# Altium project Stabilizer.PrjPCB (part 5 of 5)

## Sheet References.SchDoc: Stabilizer
size 420 x 297 mm; Author: G.Kasprowicz; CompanyName: WUT ISE; DrawnBy: G.Kasprowicz; Organization: WUT ISE; Address1: PW ISE; Address2: Nowowiejska 15/19 00-665 Warsaw; Address3: gkasprow@gmail.com; DocumentNumber: 10; Revision: 3.4; SheetNumber: 10; SheetTotal: 11; ModifiedBy: -; CheckedDate: -; Title2: References; DivGrp: WUT ISE; Designer: G.Kasprowicz; ModifiedDate: -; ProjectName: Sensor Box
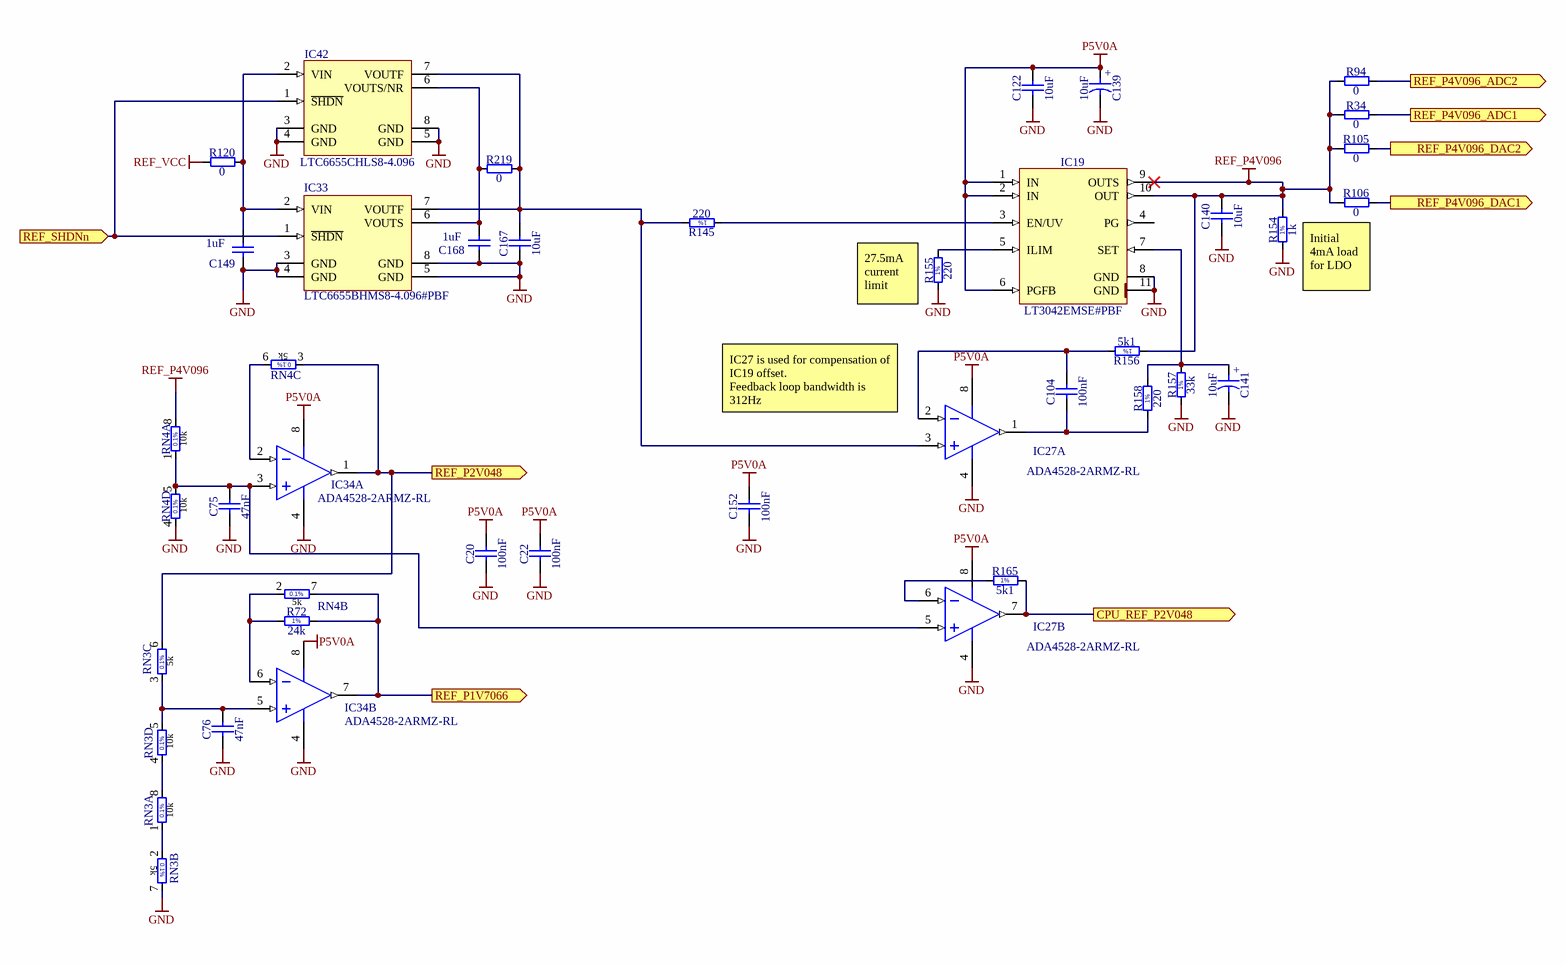
[diagram p8: References.SchDoc]

### Parts
C20  100nF  [CAPC1005X55N]
C22  100nF  [CAPC1005X55N]
C75  47nF  [CAPC2012X135N]
C76  47nF  [CAPC2012X135N]
C104  100nF  [CAPC1005X55N]
C122  10uF  [CAPC2012X95N]
C139  10uF  [CAPMP3216X180N]
C140  10uF  [CAPC2012X95N]
C141  10uF  [CAPMP3216X180N]
C149  1uF  [CAPC1608X87N]
C152  100nF  [CAPC1005X55N]
C167  10uF  [CAPC2012X95N]
C168  1uF  [CAPC1608X87N]
IC19  LT3042EMSE#PBF  [SOP50P490X110-11N-R168X198]
IC27  ADA4528-2ARMZ-RL  [ADI-RM-8_N]  (parts A,B of 2)
IC33  LTC6655BHMS8-4.096#PBF  [SOP65P490X110-8N]
IC34  ADA4528-2ARMZ-RL  [ADI-RM-8_N]  (parts A,B of 2)
IC42  LTC6655CHLS8-4.096  [LCCS127P500X500X145-8N]
R34  0  [RESC1005X40N]
R72  24k  [RESC1608X55N]
R94  0  [RESC1005X40N]
R105  0  [RESC1005X40N]
R106  0  [RESC1005X40N]
R120  0  [RESC1005X40N]
R145  220  [RESC1608X55N]
R154  1k  [RESC1608X55N]
R155  220  [RESC1608X55N]
R156  5k1  [RESC1005X40N]
R157  33k  [RESC1005X40N]
R158  220  [RESC1608X55N]
R165  5k1  [RESC1005X40N]
R219  0  [RESC1005X40N]
RN3  10k 5K 5K 10K  [SOIC127P600X175-8N]  (value not drawn)  (parts A,B,C,D of 4)
RN4  10k 5K 5K 10K  [SOIC127P600X175-8N]  (value not drawn)  (parts A,B,C,D of 4)

### Ports
CPU_REF_P2V048 (out), REF_P1V7066 (out), REF_P2V048 (out), REF_P4V096_ADC1 (out), REF_P4V096_ADC2 (out), REF_P4V096_DAC1 (out), REF_P4V096_DAC2 (out), REF_SHDNn (in)

### Nets
GND: C20.1 C22.1 C75.1 C76.1 C122.1 C139.2 C140.1 C141.2 C149.1 C152.1 C167.1 C168.1 IC19.8(GND) IC19.11(GND) IC27.4(-V) IC33.3(GND) IC33.4(GND) IC33.5(GND) IC33.8(GND) IC34.4(-V) IC42.3(GND) IC42.4(GND) IC42.5(GND) IC42.8(GND) R154.1 R155.1 R157.1 RN3.7 RN4.4
P5V0A: C20.2 C22.2 C122.2 C139.1 C152.2 IC19.1(IN) IC19.2(IN) IC19.6(PGFB) IC27.8(+V) IC34.8(+V)
REF_P4V096: C140.2 IC19.9(OUTS) IC19.10(OUT) R34.1 R94.1 R105.1 R106.1 R154.2 R156.1 RN4.8
REF_VCC: R120.1
CPU_REF_P2V048: IC27.7(OUT_B) R165.2 ; port CPU_REF_P2V048
REF_P1V7066: IC34.7(OUT_B) R72.2 RN4.7 ; port REF_P1V7066
REF_P2V048: IC34.1(OUT_A) RN3.6 RN4.3 ; port REF_P2V048
REF_P4V096_ADC: R94.2 ; port REF_P4V096_ADC2
REF_P4V096_ADC: R34.2 ; port REF_P4V096_ADC1  [a separate net that carries the same name]
REF_P4V096_DAC1: R106.2 ; port REF_P4V096_DAC1
REF_P4V096_DAC2: R105.2 ; port REF_P4V096_DAC2
REF_~{SHDN}: IC33.1(~{SHDN}) IC42.1(~{SHDN}) ; port REF_SHDNn
NetC75_2: C75.2 IC27.5(+IN_B) IC34.3(+IN_A) RN4.1 RN4.5
NetC76_2: C76.2 IC34.5(+IN_B) RN3.3 RN3.5
NetC104_1: C104.1 IC27.1(OUT_A) R158.1
NetC104_2: C104.2 IC27.2(-IN_A) R156.2
NetC141_1: C141.1 IC19.7(SET) R157.2 R158.2
NetC149_2: C149.2 IC33.2(VIN) IC42.2(VIN) R120.2
NetC167_2: C167.2 IC27.3(+IN_A) IC33.7(VOUTF) IC42.7(VOUTF) R145.2 R219.2
NetC168_2: C168.2 IC33.6(VOUTS) IC42.6(VOUTS/NR) R219.1
NetIC19_3: IC19.3(EN/UV) R145.1
NetIC19_5: IC19.5(ILIM) R155.2
NetIC27_6: IC27.6(-IN_B) R165.1
NetIC34_2: IC34.2(-IN_A) RN4.6
NetIC34_6: IC34.6(-IN_B) R72.1 RN4.2
NetRN3_1: RN3.1 RN3.2
NetRN3_4: RN3.4 RN3.8

Not connected (* = marked no-connect by the designer): IC19 4(PG)

### Notes on the sheet
- (near R155) 27.5mA current limit
- Initial 4mA load for LDO
- IC27 is used for compensation of IC19 offset.
  Feedback loop bandwidth is 312Hz
- Project/Equipment
- Document
- Designer
- Drawn by
- Check.by
- Copyright WUT ISE 2018.
  This documentation describes Open Hardware and is licensed under the CERN OHL v.1.1. You may redistribute and modify this documentation under the terms of the CERN OHL v.1.1. (http://ohwr.org/CERNOHL). This documentation is distributed WITHOUT ANY EXPRESS OR IMPLIED WARRANTY, INCLUDING OF MERCHANTABILITY, SATISFACTORY QUALITY AND FITNESS FOR A PARTICULAR PURPOSE. Please see the CERN OHL v.1.1 for applicable conditions.
- Contact
- File
- Last Mod.
- Print Date
- Sheet
- Size
- A3
- of
- Rev
- (in symbol CTE3216-18_10UF_16V_20%_AVX_TCJ) +
- (in symbol R0402_5K1_1%_0.0625W_100PPM) 1%
- (in symbol R0402_33K_1%_0.0625W_100PPM) 1%
- (in symbol R0603_1K_1%_0.1W_100PPM) 1%
- (in symbol R0603_24K_1%_0.1W_100PPM) 1%
- (in symbol R0603_220R_1%_0.1W_100PPM) 1%
- (in symbol RN_10K_5K_VISHAY_AORN2-1AT3, part A) 10k
- (in symbol RN_10K_5K_VISHAY_AORN2-1AT3, part B) 5k
- (in symbol RN_10K_5K_VISHAY_AORN2-1AT3, part C) 5k
- (in symbol RN_10K_5K_VISHAY_AORN2-1AT3, part D) 10k

### Library data of the parts
C20 C22 C104 C152 = CC0402_100NF_16V_10%_X5R: as C79-C81 on sheet RMII_Ethernet; Part Number: CC0402_100NF_16V_10%_X5R; Component Kind: Standard; Component Type: Standard; Pin Count: 2; Value: 100nF; Status: None; Manufacturer Part Number: CC0402_100NF_16V_10%_X5R; Case: 0402; Mounted: Yes; Socket: No; SMD: Yes; Sense: No; Manufacturer1 Example: MURATA; Manufacturer1 ComponentHeight: 0.55mm; HelpURL: \\cern.ch\dfs\Applications\Altium\Datasheets\CC0402_X5R_MURATA_GRM.pdf; Author: CERN DEM JLC; CreateDate: 10.12.2013; LatestRevisionDate: 10.12.2013
C75 C76 = CC0805_47NF_25V_5%_C0G: Non-polarised capacitor; Part Description: SMD Multilayer Chip Ceramic Capacitor; Manufacturer: GENERIC; Manufacturer1 Part Number: C0805C473J3GACTU; Voltage: 25V; TC: C0G/NP0; Tolerance: ±5%; Part Number: CC0805_47NF_25V_5%_C0G; Component Kind: Standard; Component Type: Standard; Pin Count: 2; Value: 47nF; Status: None; Manufacturer Part Number: CC0805_47NF_25V_5%_C0G; Case: 0805; Mounted: Yes; Socket: No; SMD: Yes; Sense: No; Manufacturer1 Example: KEMET; Manufacturer1 ComponentHeight: 1.4mm; HelpURL: \\cern.ch\dfs\Applications\Altium\Datasheets\CC0805_C0G_KEMET_(Commercial Grade).pdf; Author: CERN DEM JLC; CreateDate: 18.01.2011; LatestRevisionDate: 18.01.2011
C122 C140 C167 = CC0805_10UF_25V_10%_X5R: Non-polarised capacitor; Part Description: SMD Multilayer Chip Ceramic Capacitor; Manufacturer: GENERIC; Manufacturer1 Part Number: GRM219R61E106KA12D; Voltage: 25V; TC: X5R; Tolerance: ±10%; Part Number: CC0805_10UF_25V_10%_X5R; Component Kind: Standard; Component Type: Standard; Pin Count: 2; Value: 10uF; Status: Preferred; Manufacturer Part Number: CC0805_10UF_25V_10%_X5R; Case: 0805; Mounted: Yes; Socket: No; SMD: Yes; Sense: No; Manufacturer1 Example: MURATA; Manufacturer1 ComponentHeight: 0.95mm; HelpURL: \\cern.ch\dfs\Applications\Altium\Datasheets\CC0805_X5R_MURATA_GRM.pdf; Author: CERN DEM JLC; CreateDate: 25.10.2012; LatestRevisionDate: 06.09.2016
C139 C141 = CTE3216-18_10UF_16V_20%_AVX_TCJ: Polarised capacitor; Part Description: ESR 0R200 Tantalum Solid Electrolytic Chip Capacitor with Conductive Polymer Electrode; Manufacturer: AVX; Manufacturer Part Number: TCJA106M016R0200; Voltage: 16V; Tolerance: ±20%; Part Number: CTE3216-18_10UF_16V_20%_AVX_TCJ; Component Kind: Standard; Component Type: Standard; Pin Count: 2; Value: 10uF; Status: Preferred; Case: A; Mounted: Yes; Socket: No; SMD: Yes; Sense: No; ComponentHeight: 1.8mm; HelpURL: \\cern.ch\dfs\Applications\Altium\Datasheets\CTE_AVX_TCJ.pdf; Author: CERN DEM JLC; CreateDate: 29.03.2012; LatestRevisionDate: 29.03.2012
C149 C168 = CC0603_1UF_25V_10%_X7R: Non-polarised capacitor; Part Description: SMD Multilayer Chip Ceramic Capacitor; Manufacturer: GENERIC; Manufacturer1 Part Number: GRM188R71E105KA12D; Voltage: 25V; TC: X7R; Tolerance: ±10%; Part Number: CC0603_1UF_25V_10%_X7R; Component Kind: Standard; Component Type: Standard; Pin Count: 2; Value: 1uF; Status: None; Manufacturer Part Number: CC0603_1UF_25V_10%_X7R; Case: 0603; Mounted: Yes; Socket: No; SMD: Yes; Sense: No; Manufacturer1 Example: MURATA; Manufacturer1 ComponentHeight: 0.9mm; HelpURL: \\cern.ch\dfs\Applications\Altium\Datasheets\CC0603_X7R_MURATA.pdf; Author: CERN DEM JLC; CreateDate: 18.01.2011; LatestRevisionDate: 18.01.2011
IC19 = LT3042EMSE#PBF: 20V, 200mA, Ultralow Noise, Ultrahigh PSRR RF Linear Regulator; Manufacturer: LINEAR TECHNOLOGY; PressFit: No; Bonding: No; Part Number: LT3042EMSE#PBF; Component Kind: Standard; Component Type: Standard; Device: LT3042EMSE#PBF; PackageDescription: SOP, 0.50mm, Pitch; 10 pin, 3.00mm W X 3.00mm L X 1.10mm H body (w/thermal tab  1.68 X 1.98 mm), IPC Medium Density; Part Description: 20V, 200mA, Ultralow Noise, Ultrahigh PSRR RF Linear Regulator; Manufacturer Part Number: LT3042EMSE#PBF; Pin Count: 11; Case: MSOP10; Mounted: Yes; Socket: No; SMD: Yes; Sense: No; ComponentHeight: 1.1mm; HelpURL: \\cern.ch\dfs\Applications\Altium\Datasheets\LT3042EMSE#PBF.pdf; Author: CERN DEM MR; CreateDate: 09.06.2016; LatestRevisionDate: 09.06.2016
IC27 IC34 = CMP-0384-01794-1: Double Channel RRIO Operational Amplifier, 3.4 MHz BW, 500 mV/us SR, Industrial, 8-pin SOP (RM-8), Reel; Manufacturer: Analog Devices; V Span Max: 5.5V; Iq/Amp: 1.5mA; Amplifiers Per Package: 2; Input Bias Current: 125pA; V Span Min: 2.2V; Small Signal Bandwidth: 3.4MHz; Input Offset Voltage: 300nV; Code_JEDEC: MO-187-AA; PackageReference: RM-8; ComponentLink3Description: Package Specification; Slew Rate: 500mV/us; PartNumber: ADA4528-2ARMZ-RL; ComponentLink2Description: Datasheet; Generic Part Number: ADA4528-2; DatasheetVersion: Rev. C; ComponentLink1URL: http://www.analog.com/en/index.html; Packing: Reel; ComponentLink3URL: http://www.analog.com/static/imported-files/packages/PKG_PDF/MSOP%28RM%29/RM_8.pdf; PackageDescription: 8-Pin Mini Small Outline Package, Body 3 x 3 mm, Pitch 0.65 mm; ComponentLink2URL: http://www.analog.com/static/imported-files/data_sheets/ADA4528-1_4528-2.pdf; ComponentLink1Description: Manufacturer URL; Mounting Technology: Surface Mount
IC33 = REF_LTC6655: 0.25ppm Noise, Low Drift Precision Buffered Voltage Reference; Part Description: 4.096V, 0.25ppm Noise, Low Drift Precision Buffered Voltage Reference; Manufacturer: LINEAR TECHNOLOGY; PressFit: No; Bonding: No; Part Number: LTC6655BHMS8-4.096#PBF; Component Kind: Standard; Component Type: Standard; Device: LTC6655BHMS8-4.096#PBF; PackageDescription: SOP, 8-Leads, Body 3.1x3.1mm (max), Pitch 0.65mm, IPC Medium Density; Manufacturer Part Number: LTC6655BHMS8-4.096#PBF; Pin Count: 8; Case: SSOP8; Mounted: Yes; Socket: No; SMD: Yes; Sense: No; ComponentHeight: 1.1mm; HelpURL: \\cern.ch\dfs\Applications\Altium\Datasheets\LTC6655BHMS8-5#PBF.pdf; Author: GK; CreateDate: 07.06.2012; LatestRevisionDate: 07.06.2012
IC42 = REF_LTC6655CHLS8-4.096: 4.096, 1uA Precision Voltage Reference; Part Number: LTC6655CHLS8-4.096#PBF; Part Description: 4.096V, 0.05%, 10ppm/°C, 1uA Precision Voltage Reference; Manufacturer: LINEAR TECHNOLOGY; PressFit: No; Bonding: No; Component Kind: Standard; Component Type: Standard; Device: LTC6655CHLS8-4.096; Footprint: SOT95P280X100-6N; PackageDescription: LCC, 8-Pins, Body 5,00x5,00mmx1,45mm, Pitch 1,27mm, IPC Medium Density; Manufacturer Part Number: LTC6655CHLS8-4.096#PBF; Pin Count: 8; Case: 8-CLCC; Mounted: Yes; Socket: No; SMD: Yes; Sense: No; ComponentHeight: 1mm; HelpURL: \\cern.ch\dfs\Applications\Altium\Datasheets\LT6656ACS6-3.3#TRMPBF.pdf; Author: GK; CreateDate: 2011-10-10; LatestRevisionDate: 2011-10-10
R34 R94 R105 R106 = R0402_0R_JUMPER: Resistor; Part Description: 1A (0.05R Max DC Resistance) Zero Ohm Jumper; Manufacturer: GENERIC; Manufacturer1 Part Number: 232270591001L; PressFit: No; Part Number: R0402_0R_JUMPER; Component Kind: Standard; Component Type: Standard; Pin Count: 2; Value: 0; Status: Not Recommended; Manufacturer Part Number: R0402_0R_JUMPER; Case: 0402; Mounted: Yes; Sense: No; Socket: No; SMD: Yes; Manufacturer1 Example: YAGEO PHYCOMP; Manufacturer1 ComponentHeight: 0.4mm; HelpURL: \\cern.ch\dfs\Applications\Altium\Datasheets\R0402_Phycomp_RC0402.pdf; Author: CERN DEM JLC; CreateDate: 03.12.2007; LatestRevisionDate: 17.10.2012
R72 = R0603_24K_1%_0.1W_100PPM: Resistor - 1%; Part Description: General Purpose Thick Film Chip Resistor; Manufacturer: GENERIC; Manufacturer1 Part Number: NRC06F2402TRF; Power: 0.1W; TC: ±100ppm/°C; PressFit: No; Part Number: R0603_24K_1%_0.1W_100PPM; Component Kind: Standard; Component Type: Standard; Pin Count: 2; Value: 24k; Status: Preferred; Tolerance: ±1%; Manufacturer Part Number: R0603_24K_1%_0.1W_100PPM; Case: 0603; Mounted: Yes; Sense: No; Socket: No; SMD: Yes; Manufacturer1 Example: NIC COMPONENT; Manufacturer1 ComponentHeight: 0.55mm; HelpURL: \\cern.ch\dfs\Applications\Altium\Datasheets\R0603_NIC_NRC.pdf; Author: CERN DEM JLC; CreateDate: 03.12.2007; LatestRevisionDate: 13.03.2008
R120 R219 = R0402_0R_JUMPER: as R10 on sheet ADC_1CH; Part Number: R0402_0R_JUMPER; Component Kind: Standard; Component Type: Standard; Pin Count: 2; Value: 0; Status: Not recommended; Manufacturer Part Number: R0402_0R_JUMPER; Case: 0402; Mounted: Yes; Sense: No; Socket: No; SMD: Yes; Manufacturer1 Example: YAGEO PHYCOMP; Manufacturer1 ComponentHeight: 0.4mm; HelpURL: \\cern.ch\dfs\Applications\Altium\Datasheets\R0402_Phycomp_RC0402.pdf; Author: CERN DEM JLC; CreateDate: 03.12.2007; LatestRevisionDate: 17.10.2012
R145 R155 R158 = R0603_220R_1%_0.1W_100PPM: as R35 on sheet RMII_Ethernet; Part Number: R0603_220R_1%_0.1W_100PPM; Component Kind: Standard; Component Type: Standard; Pin Count: 2; Value: 220; Status: Preferred; Tolerance: ±1%; Manufacturer Part Number: R0603_220R_1%_0.1W_100PPM; Case: 0603; Mounted: Yes; Sense: No; Socket: No; SMD: Yes; Manufacturer1 Example: NIC COMPONENT; Manufacturer1 ComponentHeight: 0.55mm; HelpURL: \\cern.ch\dfs\Applications\Altium\Datasheets\R0603_NIC_NRC.pdf; Author: CERN DEM JLC; CreateDate: 03.12.2007; LatestRevisionDate: 13.03.2008
R154 = R0603_1K_1%_0.1W_100PPM: as R180-R183 on sheet CPU; Part Number: R0603_1K_1%_0.1W_100PPM; Component Kind: Standard; Component Type: Standard; Pin Count: 2; Value: 1k; Status: Preferred; Tolerance: ±1%; Manufacturer Part Number: R0603_1K_1%_0.1W_100PPM; Case: 0603; Mounted: Yes; Sense: No; Socket: No; SMD: Yes; Manufacturer1 Example: NIC COMPONENT; Manufacturer1 ComponentHeight: 0.55mm; HelpURL: \\cern.ch\dfs\Applications\Altium\Datasheets\R0603_NIC_NRC.pdf; Author: CERN DEM JLC; CreateDate: 03.12.2007; LatestRevisionDate: 13.03.2008
R156 R165 = R0402_5K1_1%_0.0625W_100PPM: Resistor - 1%; Part Description: General Purpose Thick Film Chip Resistor; Manufacturer: GENERIC; Manufacturer1 Part Number: 232270675102L; TC: ±100ppm/°C; PressFit: No; Part Number: R0402_5K1_1%_0.0625W_100PPM; Component Kind: Standard; Component Type: Standard; Pin Count: 2; Value: 5k1; Status: Not Recommended; Power: 0.0625W; Tolerance: ±1%; Manufacturer Part Number: R0402_5K1_1%_0.0625W_100PPM; Case: 0402; Mounted: Yes; Sense: No; Socket: No; SMD: Yes; Manufacturer1 Example: YAGEO PHYCOMP; Manufacturer1 ComponentHeight: 0.4mm; HelpURL: \\cern.ch\dfs\Applications\Altium\Datasheets\R0402_Phycomp_RC0402.pdf; Author: CERN DEM JLC; CreateDate: 03.12.2007; LatestRevisionDate: 17.10.2012
R157 = R0402_33K_1%_0.0625W_100PPM: Resistor - 1%; Part Description: General Purpose Thick Film Chip Resistor; Manufacturer: GENERIC; Manufacturer1 Part Number: 232270673303L; TC: ±100ppm/°C; PressFit: No; Part Number: R0402_33K_1%_0.0625W_100PPM; Component Kind: Standard; Component Type: Standard; Pin Count: 2; Value: 33k; Status: Not Recommended; Power: 0.0625W; Tolerance: ±1%; Manufacturer Part Number: R0402_33K_1%_0.0625W_100PPM; Case: 0402; Mounted: Yes; Sense: No; Socket: No; SMD: Yes; Manufacturer1 Example: YAGEO PHYCOMP; Manufacturer1 ComponentHeight: 0.4mm; HelpURL: \\cern.ch\dfs\Applications\Altium\Datasheets\R0402_Phycomp_RC0402.pdf; Author: CERN DEM JLC; CreateDate: 03.12.2007; LatestRevisionDate: 17.10.2012
RN3 RN4 = RN_10K_5K_VISHAY_AORN2-1AT3: DIL8 Resistor Network 4 Resistors 10k-5k-5k-10k 0.1%; Part Description: Dual-In-Line Thin Film Precision Automotive Resistors Network, (4 Isolated) - AORN Series; Manufacturer: VISHAY DALE; Power: 4x0.1W; TC: ±25ppm/°C; PressFit: No; Part Number: RN_10K_5K_VISHAY_AORN2-1AT3; Component Kind: Standard; Component Type: Standard; Pin Count: 8; Value: 10k 5K 5K 10K; Sense: No; Tolerance: 0.1%; Manufacturer Part Number: AORN2-1AT3; Case: SOIC8; Mounted: Yes; Socket: No; SMD: Yes; ComponentHeight: 1.73mm; HelpURL: \\cern.ch\dfs\Applications\Altium\Datasheets\RN_VISHAY_AORN.pdf; Author: CERN DEM JLC; CreateDate: 20.02.2017; LatestRevisionDate: 20.02.2017

## Sheet EEM_connector.SchDoc: Stabilizer
size 420 x 297 mm; Author: G.Kasprowicz; CompanyName: WUT ISE; DrawnBy: G.Kasprowicz; Organization: WUT ISE; Address1: PW ISE; Address2: Nowowiejska 15/19 00-665 Warsaw; Address3: gkasprow@gmail.com; DocumentNumber: 9; Revision: 3.4; SheetNumber: 9; SheetTotal: 11; ModifiedBy: -; CheckedDate: -; Title2: EEM connector & drivers; DivGrp: WUT ISE; Designer: G.Kasprowicz; ModifiedDate: -; ProjectName: Sensor Box
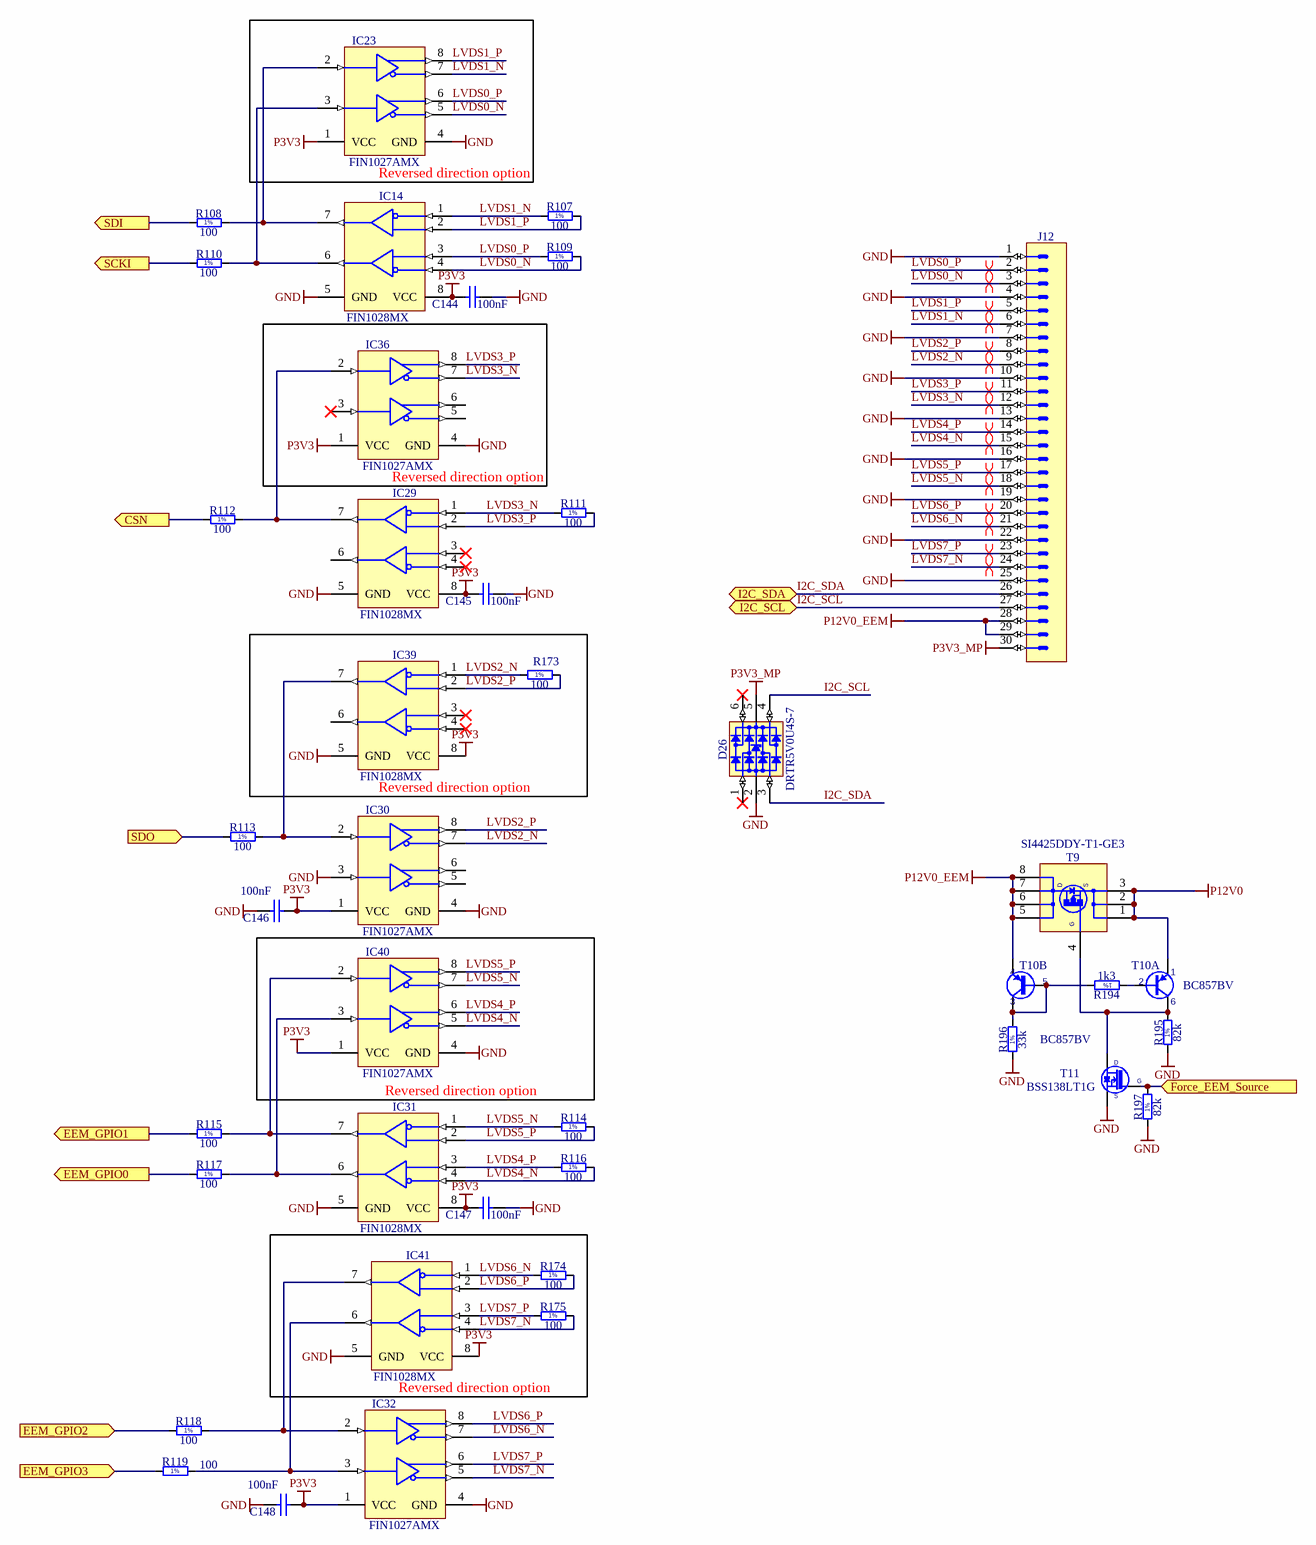
[diagram p9: EEM_connector.SchDoc]

### Parts
C144  100nF  [CAPC1005X55N]
C145  100nF  [CAPC1005X55N]
C146  100nF  [CAPC1005X55N]
C147  100nF  [CAPC1005X55N]
C148  100nF  [CAPC1005X55N]
D26  DRTR5V0U4S-7  [SOT65P210X110-6N]
IC14  FIN1028MX  [SOIC127P600X175-8N]
IC23  FIN1027AMX  [SOIC127P600X175-8N]
IC29  FIN1028MX  [SOIC127P600X175-8N]
IC30  FIN1027AMX  [SOIC127P600X175-8N]
IC31  FIN1028MX  [SOIC127P600X175-8N]
IC32  FIN1027AMX  [SOIC127P600X175-8N]
IC36  FIN1027AMX  [SOIC127P600X175-8N]
IC39  FIN1028MX  [SOIC127P600X175-8N]
IC40  FIN1027AMX  [SOIC127P600X175-8N]
IC41  FIN1028MX  [SOIC127P600X175-8N]
J12  IDC  [3M_N2530-6002RB]  (value not drawn)
R107  100  [RESC1005X40N]
R108  100  [RESC1005X40N]
R109  100  [RESC1005X40N]
R110  100  [RESC1005X40N]
R111  100  [RESC1005X40N]
R112  100  [RESC1005X40N]
R113  100  [RESC1005X40N]
R114  100  [RESC1005X40N]
R115  100  [RESC1005X40N]
R116  100  [RESC1005X40N]
R117  100  [RESC1005X40N]
R118  100  [RESC1005X40N]
R119  100  [RESC1005X40N]
R173  100  [RESC1005X40N]
R174  100  [RESC1005X40N]
R175  100  [RESC1005X40N]
R194  1k3  [RESC1608X55N]
R195  82k  [RESC1608X55N]
R196  33k  [RESC1005X40N]
R197  82k  [RESC1608X55N]
T9  SI4425DDY-T1-GE3  [SOIC127P600X175-8N]
T10  BC857BV  [SOTFL50P160X60-6N]  (parts A,B of 2)
T11  BSS138LT1G  [SOT95P240X110-3N]

### Blocks framed on the sheet
Reversed direction option: IC23
Reversed direction option: IC36
Reversed direction option: IC39 R173
Reversed direction option: IC40
Reversed direction option: IC41 R174 R175

### Ports
CSN (out), EEM_GPIO0 (out), EEM_GPIO1 (out), EEM_GPIO2 (in), EEM_GPIO3 (in), Force_EEM_Source (in), I2C_SCL (bidir), I2C_SDA (bidir), SCKI (out), SDI (out), SDO (in)

### Nets
GND: C144.1 C145.1 C146.1 C147.1 C148.1 D26.2(GND) IC14.5(GND) IC23.4(GND) IC29.5(GND) IC30.3(DIN2RIN-) IC30.4(GND) IC31.5(GND) IC32.4(GND) IC36.4(GND) IC39.5(GND) IC40.4(GND) IC41.5(GND) J12.1 J12.4 J12.7 J12.10 J12.13 J12.16 J12.19 J12.22 J12.25 R195.1 R196.1 R197.1 T11.2(S)
P3V3: C144.2 C145.2 C146.2 C147.2 C148.2 IC14.8(VCC) IC23.1(VCC) IC29.8(VCC) IC30.1(VCC) IC31.8(VCC) IC32.1(VCC) IC36.1(VCC) IC39.8(VCC) IC40.1(VCC) IC41.8(VCC)
P3V3_MP: D26.5(VBUS) J12.30
P12V0: T9.1(S) T9.2(S) T9.3(S) T10.1(E)
P12V0_EEM: J12.28 J12.29 T9.5(D) T9.6(D) T9.7(D) T9.8(D) T10.4(E)
CSN: R112.1 ; port CSN
EEM_GPIO0: R117.1 ; port EEM_GPIO0
EEM_GPIO1: R115.1 ; port EEM_GPIO1
EEM_GPIO2: R118.1 ; port EEM_GPIO2
EEM_GPIO3: R119.1 ; port EEM_GPIO3
Force_EEM_Source: R197.2 T11.1(G) ; port Force_EEM_Source
I2C_SCL: D26.4(I/O3) J12.27 ; port I2C_SCL
I2C_SDA: D26.3(I/O2) J12.26 ; port I2C_SDA
LVDS0_N: IC14.4(RIN2-) IC23.5(DOUT-) J12.3 R109.2
LVDS0_P: IC14.3(RIN2+) IC23.6(DOUT+) J12.2 R109.1
LVDS1_N: IC14.1(RIN1-) IC23.7(DOUT-) J12.6 R107.1
LVDS1_P: IC14.2(RIN1+) IC23.8(DOUT+) J12.5 R107.2
LVDS2_N: IC30.7(DOUT-) IC39.1(RIN1-) J12.9 R173.1
LVDS2_P: IC30.8(DOUT+) IC39.2(RIN1+) J12.8 R173.2
LVDS3_N: IC29.1(RIN1-) IC36.7(DOUT-) J12.12 R111.1
LVDS3_P: IC29.2(RIN1+) IC36.8(DOUT+) J12.11 R111.2
LVDS4_N: IC31.4(RIN2-) IC40.5(DOUT-) J12.15 R116.2
LVDS4_P: IC31.3(RIN2+) IC40.6(DOUT+) J12.14 R116.1
LVDS5_N: IC31.1(RIN1-) IC40.7(DOUT-) J12.18 R114.1
LVDS5_P: IC31.2(RIN1+) IC40.8(DOUT+) J12.17 R114.2
LVDS6_N: IC32.7(DOUT-) IC41.1(RIN1-) J12.21 R174.1
LVDS6_P: IC32.8(DOUT+) IC41.2(RIN1+) J12.20 R174.2
LVDS7_N: IC32.5(DOUT-) IC41.4(RIN2-) J12.24 R175.2
LVDS7_P: IC32.6(DOUT+) IC41.3(RIN2+) J12.23 R175.1
SCKI: R110.1 ; port SCKI
SDI: R108.1 ; port SDI
SDO: R113.1 ; port SDO
NetIC14_6: IC14.6(ROUT2) IC23.3(DIN2RIN-) R110.2
NetIC14_7: IC14.7(ROUT1) IC23.2(DIN1) R108.2
NetIC29_7: IC29.7(ROUT1) IC36.2(DIN1) R112.2
NetIC30_2: IC30.2(DIN1) IC39.7(ROUT1) R113.2
NetIC31_6: IC31.6(ROUT2) IC40.3(DIN2RIN-) R117.2
NetIC31_7: IC31.7(ROUT1) IC40.2(DIN1) R115.2
NetIC32_2: IC32.2(DIN1) IC41.7(ROUT1) R118.2
NetIC32_3: IC32.3(DIN2RIN-) IC41.6(ROUT2) R119.2
NetR194_1: R194.1 T10.2(B)
NetR194_2: R194.2 R196.2 T10.3(C) T10.5(B)
NetR195_2: R195.2 T9.4(S) T10.6(C) T11.3(D)

Not connected (* = marked no-connect by the designer): D26 1(I/O1)* 6(I/O4)*; IC29 3(RIN2+)* 4(RIN2-)* 6(ROUT2); IC30 5(DOUT-) 6(DOUT+); IC36 3(DIN2RIN-)* 5(DOUT-) 6(DOUT+); IC39 3(RIN2+)* 4(RIN2-)* 6(ROUT2)

### Layout directives
differential pair: LVDS0_N, LVDS0_P, LVDS1_N, LVDS1_P, LVDS2_N, LVDS2_P, LVDS3_N, LVDS3_P, LVDS4_N, LVDS4_P, LVDS5_N, LVDS5_P, LVDS6_N, LVDS6_P, LVDS7_N, LVDS7_P

### Notes on the sheet
- Project/Equipment
- Document
- Designer
- Drawn by
- Check.by
- Copyright WUT ISE 2018.
  This documentation describes Open Hardware and is licensed under the CERN OHL v.1.1. You may redistribute and modify this documentation under the terms of the CERN OHL v.1.1. (http://ohwr.org/CERNOHL). This documentation is distributed WITHOUT ANY EXPRESS OR IMPLIED WARRANTY, INCLUDING OF MERCHANTABILITY, SATISFACTORY QUALITY AND FITNESS FOR A PARTICULAR PURPOSE. Please see the CERN OHL v.1.1 for applicable conditions.
- Contact
- File
- Last Mod.
- Print Date
- Sheet
- Size
- A3
- of
- Rev
- (in symbol R0402_33K_1%_0.0625W_100PPM) 1%
- (in symbol R0402_100R_1%_0.0625W_100PPM) 1%
- (in symbol R0603_1K3_1%_0.1W_100PPM) 1%
- (in symbol R0603_82K_1%_0.1W_100PPM) 1%
- (in symbol SI4425DDY-T1-GE3) G

### Library data of the parts
C144-C148 = CC0402_100NF_16V_10%_X5R: Non-polarised capacitor; Part Description: SMD Multilayer Chip Ceramic Capacitor; Manufacturer: GENERIC; Manufacturer1 Part Number: GRM155R61C104KA88D; Voltage: 16V; TC: X5R; Tolerance: ±10%; Part Number: CC0402_100NF_16V_10%_X5R; Component Kind: Standard; Component Type: Standard; Pin Count: 2; Value: 100nF; Status: None; Manufacturer Part Number: CC0402_100NF_16V_10%_X5R; Case: 0402; Mounted: Yes; Socket: No; SMD: Yes; Sense: No; Manufacturer1 Example: MURATA; Manufacturer1 ComponentHeight: 0.55mm; HelpURL: \\cern.ch\dfs\Applications\Altium\Datasheets\CC0402_X5R_MURATA_GRM.pdf; Author: CERN DEM JLC; CreateDate: 10.12.2013; LatestRevisionDate: 10.12.2013
D26 = D_TVS_DRTR5V0U4S-7: Integrated Quad Ultra-Low Capacitance ESD Protection; Part Description: Integrated Quad Ultra-Low Capacitance ESD (±8kV) Protection; Manufacturer: DIODES; PressFit: No; Bonding: No; Status Comment: Active; Part Number: DRTR5V0U4S-7; Component Kind: Standard; Component Type: Standard; Device: DRTR5V0U4S-7; PackageDescription: SOT363, SC70-6, 0.65mm Pitch; 6 Pin, 1.25mm W X 2.00mm L X 1.10mm H body, IPC Medium Density; Status: Active; Manufacturer Part Number: DRTR5V0U4S-7; Pin Count: 6; Case: SOT363; Mounted: Yes; Socket: No; SMD: Yes; Sense: No; ComponentHeight: 1.1mm; HelpURL: \\cern.ch\dfs\Applications\Altium\Datasheets\PRTR5V0U4Y.pdf; Author: GK; CreateDate: 24.01.2017; LatestRevisionDate: 14.09.2020
IC14 IC29 IC31 IC39 IC41 = IFC_FIN1028: 3.3V LVDS 2-Bit High-Speed Differential Reciever; Manufacturer: ON Semiconductor; PressFit: No; Bonding: No; Part Number: FIN1028MX; Component Kind: Standard; Component Type: Standard; Device: FIN1028MX; PackageDescription: SOIC 8, Pitch 1.27mm - Body 4x5mm, IPC Medium Density; Part Description: 3.3V LVDS 2-Bit High-Speed Differential Reciever; Manufacturer Part Number: FIN1028MX; Pin Count: 8; Case: SOIC8; Mounted: Yes; Socket: No; SMD: Yes; Sense: No; ComponentHeight: 0.8mm; Author: GK; HelpURL: \\cern.ch\dfs\Applications\Altium\Datasheets\FIN1101K8X.pdf; CreateDate: 08/11/2016; LatestRevisionDate: 08/11/2016
IC23 IC30 IC32 IC36 IC40 = IFC_FIN1027A: 3.3V LVDS, 2-Bit, High-Speed, Differential Driver; Manufacturer: ON Semiconductor; PressFit: No; Bonding: No; Part Number: FIN1027AMX; Component Kind: Standard; Component Type: Standard; Device: FIN1027AMX; PackageDescription: SOIC 8, Pitch 1.27mm - Body 4x5mm, IPC Medium Density; Part Description: 3.3V LVDS, 2-Bit, High-Speed, Differential Driver; Manufacturer Part Number: FIN1027AMX; Pin Count: 8; Case: SOIC8; Mounted: Yes; Socket: No; SMD: Yes; Sense: No; ComponentHeight: 0.8mm; Author: GK; HelpURL: \\cern.ch\dfs\Applications\Altium\Datasheets\FIN1101K8X.pdf; CreateDate: 08/11/2016; LatestRevisionDate: 08/11/2016
J12 = 3M_N2530-6002RB: Connector 30 Male; Part Description: 30 Contacts - Straight .100'' x .100'' Low Profile Four-Wall Header, 2500 Series; Manufacturer: 3M; PressFit: No; Part Number: 3M_N2530-6002RB; Component Kind: Standard; Component Type: Standard; Pin Count: 30; Family: Header 30; Mounted: Yes; Socket: No; SMD: No; Sense: No; Status: None; Manufacturer Part Number: N2530-6002RB; ComponentHeight: 10.03mm; HelpURL: \\cern.ch\dfs\Applications\Altium\Datasheets\3M_N2530-6002RB.pdf; Author: CERN DEM JLC; CreateDate: 11.02.2009; LatestRevisionDate: 11.08.2009
R107-R119 R173-R175 = R0402_100R_1%_0.0625W_100PPM: Resistor - 1%; Part Description: General Purpose Thick Film Chip Resistor; Manufacturer: GENERIC; Manufacturer1 Part Number: 232270671001L; TC: ±100ppm/°C; PressFit: No; Part Number: R0402_100R_1%_0.0625W_100PPM; Component Kind: Standard; Component Type: Standard; Pin Count: 2; Value: 100; Status: Not Recommended; Power: 0.0625W; Tolerance: ±1%; Manufacturer Part Number: R0402_100R_1%_0.0625W_100PPM; Case: 0402; Mounted: Yes; Sense: No; Socket: No; SMD: Yes; Manufacturer1 Example: YAGEO PHYCOMP; Manufacturer1 ComponentHeight: 0.4mm; HelpURL: \\cern.ch\dfs\Applications\Altium\Datasheets\R0402_Phycomp_RC0402.pdf; Author: CERN DEM JLC; CreateDate: 03.12.2007; LatestRevisionDate: 17.10.2012
R194 = R0603_1K3_1%_0.1W_100PPM: Resistor - 1%; Part Description: General Purpose Thick Film Chip Resistor; Manufacturer: GENERIC; Manufacturer1 Part Number: NRC06F1301TRF; Power: 0.1W; TC: ±100ppm/°C; PressFit: No; Part Number: R0603_1K3_1%_0.1W_100PPM; Component Kind: Standard; Component Type: Standard; Pin Count: 2; Value: 1k3; Status: Preferred; Tolerance: ±1%; Manufacturer Part Number: R0603_1K3_1%_0.1W_100PPM; Case: 0603; Mounted: Yes; Sense: No; Socket: No; SMD: Yes; Manufacturer1 Example: NIC COMPONENT; Manufacturer1 ComponentHeight: 0.55mm; HelpURL: \\cern.ch\dfs\Applications\Altium\Datasheets\R0603_NIC_NRC.pdf; Author: CERN DEM JLC; CreateDate: 03.12.2007; LatestRevisionDate: 13.03.2008
R195 R197 = R0603_82K_1%_0.1W_100PPM: Resistor - 1%; Part Description: General Purpose Thick Film Chip Resistor; Manufacturer: GENERIC; Manufacturer1 Part Number: NRC06F8202TRF; Power: 0.1W; TC: ±100ppm/°C; Part Number: R0603_82K_1%_0.1W_100PPM; Component Kind: Standard; Component Type: Standard; Pin Count: 2; Value: 82k; Status: Preferred; Tolerance: ±1%; Manufacturer Part Number: R0603_82K_1%_0.1W_100PPM; Case: 0603; Mounted: Yes; Sense: No; Socket: No; SMD: Yes; Manufacturer1 Example: NIC COMPONENT; Manufacturer1 ComponentHeight: 0.55mm; HelpURL: \\cern.ch\dfs\Applications\Altium\Datasheets\R0603_NIC_NRC.pdf; Author: CERN DEM JLC; CreateDate: 03.12.2007; LatestRevisionDate: 13.03.2008
R196 = R0402_33K_1%_0.0625W_100PPM: Resistor - 1%; Part Description: General Purpose Thick Film Chip Resistor; Manufacturer: GENERIC; Manufacturer1 Part Number: 232270673303L; TC: ±100ppm/°C; PressFit: No; Part Number: R0402_33K_1%_0.0625W_100PPM; Component Kind: Standard; Component Type: Standard; Pin Count: 2; Value: 33k; Status: Not Recommended; Power: 0.0625W; Tolerance: ±1%; Manufacturer Part Number: R0402_33K_1%_0.0625W_100PPM; Case: 0402; Mounted: Yes; Sense: No; Socket: No; SMD: Yes; Manufacturer1 Example: YAGEO PHYCOMP; Manufacturer1 ComponentHeight: 0.4mm; HelpURL: \\cern.ch\dfs\Applications\Altium\Datasheets\R0402_Phycomp_RC0402.pdf; Author: CERN DEM JLC; CreateDate: 03.12.2007; LatestRevisionDate: 17.10.2012
T9 = SI4425DDY-T1-GE3: -30V -19.7A P-Channel MOSFET; Manufacturer: VISHAY SILICONIX; PressFit: No; Bonding: No; Part Number: SI4425DDY-T1-GE3; Component Kind: Standard; Component Type: Standard; Device: SI4425DDY-T1-GE3; PackageDescription: SOIC 8, Pitch 1.27mm - Body 4x5mm, IPC Medium Density; Part Description: -30V -19.7A P-Channel MOSFET; Manufacturer Part Number: SI4425DDY-T1-GE3; Pin Count: 8; Case: SOIC8; Mounted: Yes; Socket: No; SMD: Yes; Sense: No; ComponentHeight: 1.75mm; HelpURL: \\cern.ch\dfs\Applications\Altium\Datasheets\SI4425DDY-T1-GE3.pdf; Author: CERN DEM MR; CreateDate: 05/10/2016; LatestRevisionDate: 05/10/2016
T10 = BC857BV: 45V, 100mA PNP General Purpose Double Transistor; Part Description: -45V -100mA PNP General Purpose Double Transistor; Manufacturer: NXP SEMICONDUCTORS; PressFit: No; Bonding: No; Part Number: BC857BV; Component Kind: Standard; Component Type: Standard; Device: BC857BV; PackageDescription: SOTFL (SOT666), 0.50mm, Pitch; 6 Pin, 1.20mm W X 1.60mm L X 0.60mm H Body, IPC Medium Density; Manufacturer Part Number: BC857BV; Pin Count: 6; Case: SOT666; Mounted: Yes; Socket: No; SMD: Yes; Sense: No; ComponentHeight: 0.6mm; HelpURL: \\cern.ch\dfs\Applications\Altium\Datasheets\BC857BV.pdf; Author: CERN DEM JLC; CreateDate: 01/12/2011; LatestRevisionDate: 01/12/2011
T11 = BSS138LT1G: N-CHANNEL MOSFET WITH DIODE; Part Description: 50V 200mA N-Channel Enhancement Mode Field-Effect Transistor; Manufacturer: ON SEMICONDUCTOR; PressFit: No; Bonding: No; Part Number: BSS138LT1G; Component Kind: Standard; Component Type: Standard; Device: BSS138LT1G; PackageDescription: SOT23 3-Leads, Pitch 0.95mm - Body 1.4x3mm, IPC Medium Density; Manufacturer Part Number: BSS138LT1G; Pin Count: 3; Case: SOT23-3; Mounted: Yes; Socket: No; SMD: Yes; Sense: No; ComponentHeight: 1.11mm; HelpURL: \\cern.ch\dfs\Applications\Altium\Datasheets\BSS138LT1G.pdf; Author: CERN DEM JLC; CreateDate: 23.03.2009; LatestRevisionDate: 23.03.2009

## Sheet AUX_Analog_IO.SchDoc: Stabilizer
size 420 x 297 mm; Author: G.Kasprowicz; CompanyName: WUT ISE; DrawnBy: G.Kasprowicz; Organization: WUT ISE; Address1: PW ISE; Address2: Nowowiejska 15/19 00-665 Warsaw; Address3: gkasprow@gmail.com; DocumentNumber: 11; Revision: 3.4; SheetNumber: 11; SheetTotal: 11; ModifiedBy: -; CheckedDate: -; Title2: AUX connector; DivGrp: WUT ISE; Designer: G.Kasprowicz; ModifiedDate: -; ProjectName: Sensor Box
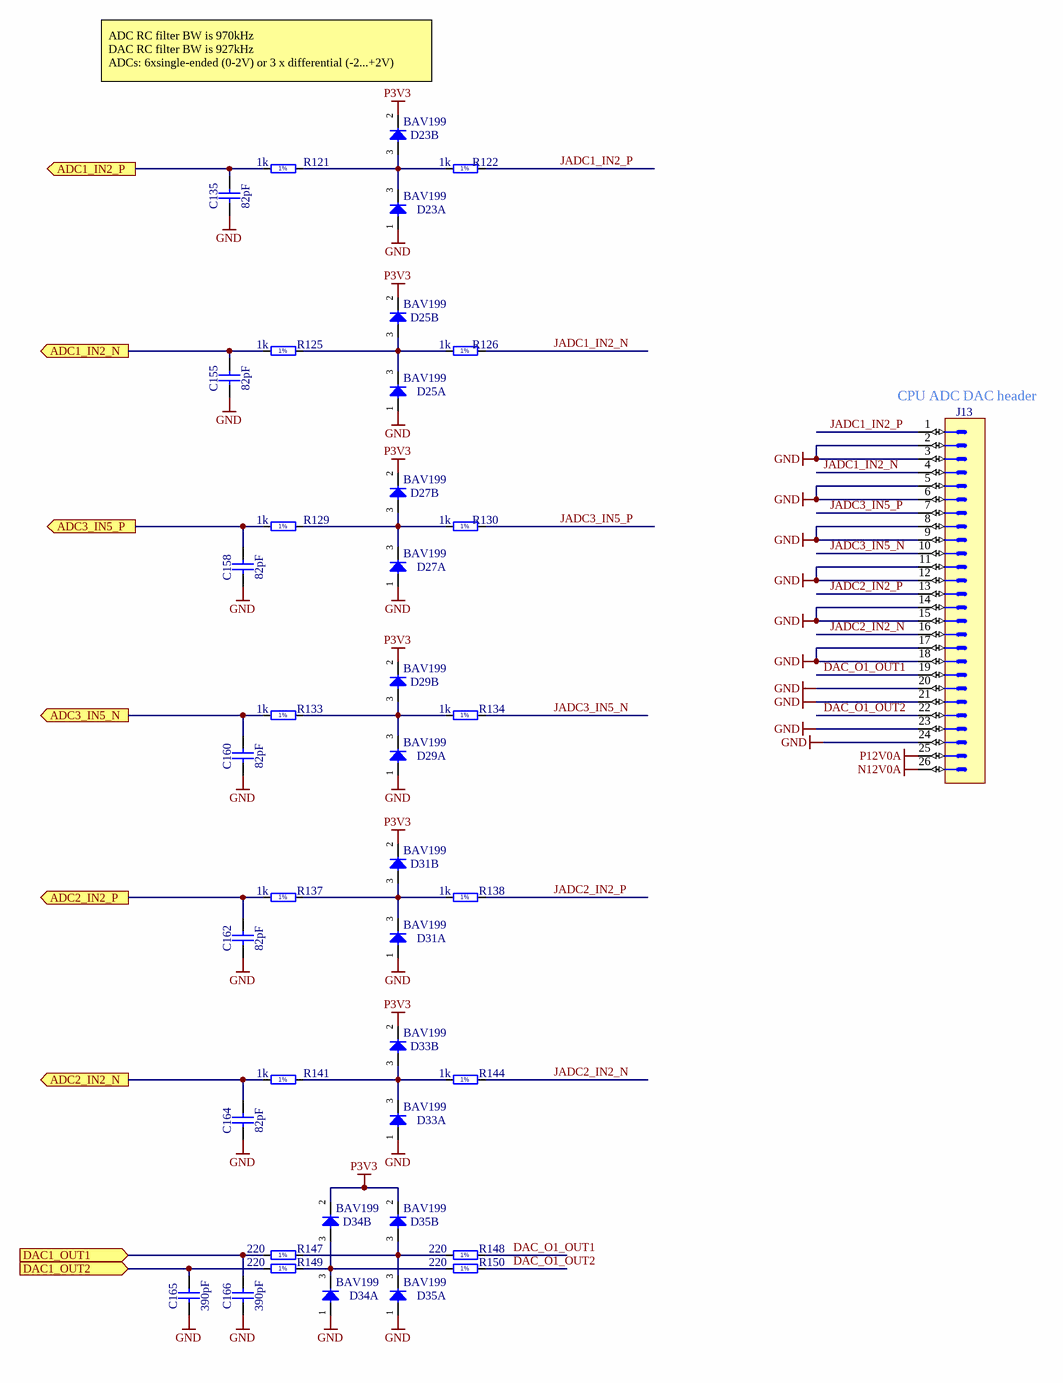
[diagram p10: AUX_Analog_IO.SchDoc]

### Parts
C135  82pF  [CAPC1608X87N]
C155  82pF  [CAPC1608X87N]
C158  82pF  [CAPC1608X87N]
C160  82pF  [CAPC1608X87N]
C162  82pF  [CAPC1608X87N]
C164  82pF  [CAPC1608X87N]
C165  390pF  [CAPC1608X87N]
C166  390pF  [CAPC1608X87N]
D23  BAV199  [SOT95P240X110-3N]  (parts A,B of 2)
D25  BAV199  [SOT95P240X110-3N]  (parts A,B of 2)
D27  BAV199  [SOT95P240X110-3N]  (parts A,B of 2)
D29  BAV199  [SOT95P240X110-3N]  (parts A,B of 2)
D31  BAV199  [SOT95P240X110-3N]  (parts A,B of 2)
D33  BAV199  [SOT95P240X110-3N]  (parts A,B of 2)
D34  BAV199  [SOT95P240X110-3N]  (parts A,B of 2)
D35  BAV199  [SOT95P240X110-3N]  (parts A,B of 2)
J13  Use original!  [3M_N2526-6002RB]  (value not drawn)
R121  1k  [RESC1608X55N]
R122  1k  [RESC1608X55N]
R125  1k  [RESC1608X55N]
R126  1k  [RESC1608X55N]
R129  1k  [RESC1608X55N]
R130  1k  [RESC1608X55N]
R133  1k  [RESC1608X55N]
R134  1k  [RESC1608X55N]
R137  1k  [RESC1608X55N]
R138  1k  [RESC1608X55N]
R141  1k  [RESC1608X55N]
R144  1k  [RESC1608X55N]
R147  220  [RESC1608X55N]
R148  220  [RESC1608X55N]
R149  220  [RESC1608X55N]
R150  220  [RESC1608X55N]

### Ports
ADC1_IN2_N (out), ADC1_IN2_P (out), ADC2_IN2_N (out), ADC2_IN2_P (out), ADC3_IN5_N (out), ADC3_IN5_P (out), DAC1_OUT1 (in), DAC1_OUT2 (in)

### Nets
GND: C135.1 C155.1 C158.1 C160.1 C162.1 C164.1 C165.1 C166.1 D23.1(A) D25.1(A) D27.1(A) D29.1(A) D31.1(A) D33.1(A) D34.1(A) D35.1(A) J13.2 J13.3 J13.5 J13.6 J13.8 J13.9 J13.11 J13.12 J13.14 J13.15 J13.17 J13.18 J13.20 J13.21 J13.23 J13.24
N12V0A: J13.26
P3V3: D23.2(C) D25.2(C) D27.2(C) D29.2(C) D31.2(C) D33.2(C) D34.2(C) D35.2(C)
P12V0A: J13.25
ADC1_IN2_N: C155.2 R125.1 ; port ADC1_IN2_N
ADC1_IN2_P: C135.2 R121.1 ; port ADC1_IN2_P
ADC2_IN2_N: C164.2 R141.1 ; port ADC2_IN2_N
ADC2_IN2_P: C162.2 R137.1 ; port ADC2_IN2_P
ADC3_IN5_N: C160.2 R133.1 ; port ADC3_IN5_N
ADC3_IN5_P: C158.2 R129.1 ; port ADC3_IN5_P
DAC1_OUT1: C166.2 R147.1 ; port DAC1_OUT1
DAC1_OUT2: C165.2 R149.1 ; port DAC1_OUT2
DAC_O1_OUT1: J13.19 R148.2
DAC_O1_OUT2: J13.22 R150.2
JADC1_IN2_N: J13.4 R126.2
JADC1_IN2_P: J13.1 R122.2
JADC2_IN2_N: J13.16 R144.2
JADC2_IN2_P: J13.13 R138.2
JADC3_IN5_N: J13.10 R134.2
JADC3_IN5_P: J13.7 R130.2
NetD23_3: D23.3(COMAC) R121.2 R122.1
NetD25_3: D25.3(COMAC) R125.2 R126.1
NetD27_3: D27.3(COMAC) R129.2 R130.1
NetD29_3: D29.3(COMAC) R133.2 R134.1
NetD31_3: D31.3(COMAC) R137.2 R138.1
NetD33_3: D33.3(COMAC) R141.2 R144.1
NetD34_3: D34.3(COMAC) R149.2 R150.1
NetD35_3: D35.3(COMAC) R147.2 R148.1

### Notes on the sheet
- (near D23) ADC RC filter BW is 970kHz
  DAC RC filter BW is 927kHz
  ADCs: 6xsingle-ended (0-2V) or 3 x differential (-2...+2V)
- (near J13) CPU ADC DAC header
- Project/Equipment
- Document
- Designer
- Drawn by
- Check.by
- Copyright WUT ISE 2018.
  This documentation describes Open Hardware and is licensed under the CERN OHL v.1.1. You may redistribute and modify this documentation under the terms of the CERN OHL v.1.1. (http://ohwr.org/CERNOHL). This documentation is distributed WITHOUT ANY EXPRESS OR IMPLIED WARRANTY, INCLUDING OF MERCHANTABILITY, SATISFACTORY QUALITY AND FITNESS FOR A PARTICULAR PURPOSE. Please see the CERN OHL v.1.1 for applicable conditions.
- Contact
- File
- Last Mod.
- Print Date
- Sheet
- Size
- A3
- of
- Rev
- (in symbol R0603_1K_1%_0.1W_100PPM) 1%
- (in symbol R0603_220R_1%_0.1W_100PPM) 1%

### Library data of the parts
C135 C155 C158 C160 C162 C164 = CC0603_82PF_50V_5%_NP0: Non-polarised capacitor; Part Description: SMD Multilayer Chip Ceramic Capacitor; Manufacturer: GENERIC; Manufacturer1 Part Number: 223886715829; Voltage: 50V; TC: C0G/NP0; Tolerance: ±5%; Part Number: CC0603_82PF_50V_5%_NP0; Component Kind: Standard; Component Type: Standard; Pin Count: 2; Value: 82pF; Status: Preferred; Manufacturer Part Number: CC0603_82PF_50V_5%_NP0; Case: 0603; Mounted: Yes; Socket: No; SMD: Yes; Sense: No; Manufacturer1 Example: PHYCOMP; Manufacturer1 ComponentHeight: 0.87mm; HelpURL: \\cern.ch\dfs\Applications\Altium\Datasheets\CC0603_NP0_PHYCOMP.pdf; Author: CERN DEM JLC; CreateDate: 03.12.2007; LatestRevisionDate: 03.12.2007
C165 C166 = CC0603_390PF_50V_5%_NP0: Non-polarised capacitor; Part Description: SMD Multilayer Chip Ceramic Capacitor; Manufacturer: GENERIC; Manufacturer1 Part Number: 223886715391; Voltage: 50V; TC: NP0; Tolerance: ±5%; Part Number: CC0603_390PF_50V_5%_NP0; Component Kind: Standard; Component Type: Standard; Pin Count: 2; Value: 390pF; Status: Preferred; Manufacturer Part Number: CC0603_390PF_50V_5%_NP0; Case: 0603; Mounted: Yes; Socket: No; SMD: Yes; Sense: No; Manufacturer1 Example: PHYCOMP; Manufacturer1 ComponentHeight: 0.87mm; HelpURL: \\cern.ch\dfs\Applications\Altium\Datasheets\CC0603_NP0_PHYCOMP.pdf; Author: CERN DEM JLC; CreateDate: 03.12.2007; LatestRevisionDate: 03.12.2007
D23 D25 D27 D29 D31 D33-D35 = BAV199: Serial Diode; Part Description: Low-Leakage Double Diode; Manufacturer: NXP SEMICONDUCTORS; Voltage: 75V; Power: 250mW; PressFit: No; Bonding: No; Part Number: BAV199; Component Kind: Standard; Component Type: Standard; Device: BAV199; PackageDescription: SOT23 3-Leads, Pitch 0.95mm - Body 1.4x3mm, IPC Medium Density; Manufacturer Part Number: BAV199; Pin Count: 3; Case: SOT23-3; Mounted: Yes; Socket: No; SMD: Yes; Sense: No; ComponentHeight: 1.1mm; HelpURL: \\cern.ch\dfs\Applications\Altium\Datasheets\BAV199.pdf; Author: CERN DEM JMW; CreateDate: 2008-11-21; LatestRevisionDate: 2008-11-21
J13 = 3M_N2526-6002RB: Connector 26 Male; Part Number: Use original! 3M_N2526-6002RB; Part Description: 26 Contacts - Straight .100'' x .100'' Low Profile Four-Wall Header, 2500 Series; Manufacturer: 3M; Manufacturer Part Number: Use original! N2526-6002RB; PressFit: No; Component Kind: Standard; Component Type: Standard; Pin Count: 26; Family: Header 26; Mounted: Yes; Socket: No; SMD: No; Sense: No; Status: None; ComponentHeight: 10.03mm; HelpURL: \\cern.ch\dfs\Applications\Altium\Datasheets\3M_N2526-6002RB.pdf; Author: CERN DEM JLC; CreateDate: 11.02.2009; LatestRevisionDate: 11.08.2009
R121 R122 R125 R126 R129 R130 R133 R134 R137 R138 R141 R144 = R0603_1K_1%_0.1W_100PPM: Resistor - 1%; Part Description: General Purpose Thick Film Chip Resistor; Manufacturer: GENERIC; Manufacturer1 Part Number: NRC06F1001TRF; Power: 0.1W; TC: ±100ppm/°C; PressFit: No; Part Number: R0603_1K_1%_0.1W_100PPM; Component Kind: Standard; Component Type: Standard; Pin Count: 2; Value: 1k; Status: Preferred; Tolerance: ±1%; Manufacturer Part Number: R0603_1K_1%_0.1W_100PPM; Case: 0603; Mounted: Yes; Sense: No; Socket: No; SMD: Yes; Manufacturer1 Example: NIC COMPONENT; Manufacturer1 ComponentHeight: 0.55mm; HelpURL: \\cern.ch\dfs\Applications\Altium\Datasheets\R0603_NIC_NRC.pdf; Author: CERN DEM JLC; CreateDate: 03/12/2007; LatestRevisionDate: 13/03/2008
R147-R150 = R0603_220R_1%_0.1W_100PPM: Resistor - 1%; Part Description: General Purpose Thick Film Chip Resistor; Manufacturer: GENERIC; Manufacturer1 Part Number: NRC06F2200TRF; Power: 0.1W; TC: ±100ppm/°C; PressFit: No; Part Number: R0603_220R_1%_0.1W_100PPM; Component Kind: Standard; Component Type: Standard; Pin Count: 2; Value: 220; Status: Preferred; Tolerance: ±1%; Manufacturer Part Number: R0603_220R_1%_0.1W_100PPM; Case: 0603; Mounted: Yes; Sense: No; Socket: No; SMD: Yes; Manufacturer1 Example: NIC COMPONENT; Manufacturer1 ComponentHeight: 0.55mm; HelpURL: \\cern.ch\dfs\Applications\Altium\Datasheets\R0603_NIC_NRC.pdf; Author: CERN DEM JLC; CreateDate: 03/12/2007; LatestRevisionDate: 13/03/2008

## Nets that join several sheets
GND: Stabilizer (45 pins), Supply_Stabilizer (117 pins), RMII_Ethernet (22 pins), USB (6 pins), CPU (41 pins), Input_AFE0 (21 pins), ADC_1CH (18 pins), DAC_1CH0 (24 pins), ADC_1CH (18 pins), Input_AFE1 (21 pins), References (29 pins), DAC_1CH1 (24 pins), EEM_connector (30 pins), AUX_Analog_IO (32 pins)
N12V0A: Stabilizer (J4.16), Supply_Stabilizer (11 pins), Input_AFE0 (8 pins), DAC_1CH0 (L18A.1), Input_AFE1 (8 pins), DAC_1CH1 (L18B.1), AUX_Analog_IO (J13.26)
P2V5A: Supply_Stabilizer (9 pins), ADC_1CH (7 pins), ADC_1CH (7 pins)
P3V3: Stabilizer (19 pins), Supply_Stabilizer (11 pins), RMII_Ethernet (8 pins), CPU (38 pins), DAC_1CH0 (R217A.1), DAC_1CH1 (R217B.1), EEM_connector (15 pins), AUX_Analog_IO (8 pins)
P3V3_MP: Stabilizer (C17.2 IC6.4 IC48.8 TP15.1), Supply_Stabilizer (D18.1 R160.1), EEM_connector (D26.5 J12.30)
P5V0A: Supply_Stabilizer (8 pins), ADC_1CH (C6A.2 C54A.2 IC38A.4), DAC_1CH0 (L16A.1 R164A.1), ADC_1CH (C6B.2 C54B.2 IC38B.4), References (10 pins), DAC_1CH1 (L16B.1 R164B.1)
P12V0: Stabilizer (J3.31 J3.32 J3.33), Supply_Stabilizer (13 pins), EEM_connector (T9.1 T9.2 T9.3 T10.1)
P12V0A: Stabilizer (J4.15 R70.2 R71.2), Supply_Stabilizer (9 pins), Input_AFE0 (7 pins), DAC_1CH0 (L2A.1), Input_AFE1 (7 pins), DAC_1CH1 (L2B.1), AUX_Analog_IO (J13.25)
REF_P4V096: Supply_Stabilizer (R22.1), References (10 pins)
REF_VCC: Supply_Stabilizer (9 pins), References (R120.1)
ADC1_IN2_N: CPU (IC9.50), AUX_Analog_IO (C155.2 R125.1)
ADC1_IN2_P: CPU (IC9.49), AUX_Analog_IO (C135.2 R121.1)
ADC2_1_IN5_N: CPU (IC9.46), Input_AFE0 (C151A.2 R162A.1 R163A.2)
ADC2_1_IN5_P: CPU (IC9.47), Input_AFE0 (C150A.2 R15A.1 R161A.2)
ADC2_IN2_N: CPU (IC9.53), AUX_Analog_IO (C164.2 R141.1)
ADC2_IN2_P: CPU (IC9.54), AUX_Analog_IO (C162.2 R137.1)
ADC3_IN2_N: CPU (IC9.22), Input_AFE1 (C151B.2 R162B.1 R163B.2)
ADC3_IN2_P: CPU (IC9.21), Input_AFE1 (C150B.2 R15B.1 R161B.2)
ADC3_IN5_N: CPU (IC9.14), AUX_Analog_IO (C160.2 R133.1)
ADC3_IN5_P: CPU (IC9.13), AUX_Analog_IO (C158.2 R129.1)
ADC_0_N: Stabilizer (J4.3 J15.2), Input_AFE0 (L14A.2 R86A.1 SW1A.1)
ADC_0_P: Stabilizer (J4.2 J15.1), Input_AFE0 (L14A.1 R79A.1 R83A.2)
ADC_1_N: Stabilizer (J4.6 J16.2), Input_AFE1 (L14B.2 R86B.1 SW1B.1)
ADC_1_P: Stabilizer (J4.5 J16.1), Input_AFE1 (L14B.1 R79B.1 R83B.2)
AFE0_A0: CPU (IC9.12), Input_AFE0 (IC18A.4)
AFE0_A1: CPU (IC9.15), Input_AFE0 (IC18A.5)
AFE1_A0: CPU (IC9.85), Input_AFE1 (IC18B.4)
AFE1_A1: CPU (IC9.86), Input_AFE1 (IC18B.5)
AFE_PWR_ON: Supply_Stabilizer (R223.1), CPU (IC9.142)
AT_EVENT: Supply_Stabilizer (IC28.4 R139.1), CPU (IC9.8)
CLRn: Stabilizer (R218.1 TP20.1), CPU (IC9.65), DAC_1CH0 (IC37A.10), DAC_1CH1 (IC37B.10)
CPU_REF_P2V048: CPU (R95.1), References (IC27.7 R165.2)
CPU_RESETn: Supply_Stabilizer (IC15.7 R51.2 T8.1), CPU (R14.2)
CSN: CPU (IC9.93), EEM_connector (R112.1)
DAC0_LDACn: CPU (R167.1), DAC_1CH0 (IC37A.11 IC46A.11 R217A.2 TP19A.1)
DAC1_LDACn: CPU (R169.1), DAC_1CH1 (IC37B.11 IC46B.11 R217B.2 TP19B.1)
DAC1_OUT1: CPU (IC9.40), DAC_1CH0 (C153A.2), AUX_Analog_IO (C166.2 R147.1)
DAC1_OUT2: CPU (IC9.41), DAC_1CH1 (C153B.2), AUX_Analog_IO (C165.2 R149.1)
DAC_0_N: Stabilizer (J4.9 J17.2), DAC_1CH0 (L8A.3 R67A.2)
DAC_0_P: Stabilizer (J4.8 J17.1), DAC_1CH0 (L8A.4 R66A.2)
DAC_1_N: Stabilizer (J4.12 J18.2), DAC_1CH1 (L8B.3 R67B.2)
DAC_1_P: Stabilizer (J4.11 J18.1), DAC_1CH1 (L8B.4 R66B.2)
DI0: Stabilizer (R216.2), CPU (IC9.124 R176.2)
DI1: Stabilizer (R209.2), CPU (IC9.9 R177.1)
DO0: Stabilizer (R17.2), CPU (IC9.79)
DO1: Stabilizer (R1.2), CPU (IC9.82)
EEM_GPIO0: CPU (R178.1 R179.1), EEM_connector (R117.1)
EEM_GPIO1: CPU (IC9.116), EEM_connector (R115.1)
EEM_GPIO2: CPU (IC9.117), EEM_connector (R118.1)
EEM_GPIO3: CPU (IC9.118), EEM_connector (R119.1)
ETH_PHY_NRST: RMII_Ethernet (IC11.15 R198.2), CPU (IC9.2)
Force_EEM_Source: CPU (IC9.141), EEM_connector (R197.2 T11.1)
FP_LED_0: Stabilizer (R58.2), CPU (IC9.119)
FP_LED_1: Stabilizer (R76.2), CPU (IC9.122)
FP_LED_2: Stabilizer (R77.2), CPU (IC9.89)
FP_LED_3: Stabilizer (R78.2), CPU (IC9.81)
HRTIM_CHA1: Stabilizer (J3.14), CPU (IC9.96)
HRTIM_CHA2: Stabilizer (J3.15), CPU (IC9.97)
HRTIM_CHE1: Stabilizer (J3.11), CPU (IC9.91)
HRTIM_CHE2: Stabilizer (J3.12), CPU (IC9.92)
I2C1_SCL: Stabilizer (J3.27), CPU (IC9.139)
I2C1_SDA: Stabilizer (J3.26), CPU (IC9.137)
I2C2_SCL: Stabilizer (R23.2 T3.2), CPU (IC9.11)
I2C2_SDA: Stabilizer (R74.2 T1.2), CPU (IC9.10)
I2C_SCL: Stabilizer (IC6.1 IC48.6 T3.3 TP14.1), EEM_connector (D26.4 J12.27)
I2C_SDA: Stabilizer (IC6.3 IC48.5 T1.3 TP6.1), EEM_connector (D26.3 J12.26)
IN_N: Input_AFE0 (C119A.2 C125A.2 R84A.2), ADC_1CH (IC38B.7)
IN_N: ADC_1CH (IC38A.7), Input_AFE1 (C119B.2 C125B.2 R84B.2)
IN_P: Input_AFE0 (C125A.1 C126A.1 R90A.2), ADC_1CH (IC38B.6)
IN_P: ADC_1CH (IC38A.6), Input_AFE1 (C125B.1 C126B.1 R90B.2)
LPTIM2_OUT: Stabilizer (J3.17), CPU (IC9.74)
OEn_DO0: Stabilizer (IC2.1 R214.1), CPU (IC9.67)
OEn_DO1: Stabilizer (IC21.1 R203.1), CPU (IC9.66)
PA0/UART4_TX: Stabilizer (J3.18), CPU (IC9.34 R207.2)
PC2_ADC3_IN1_N: Stabilizer (J3.29), CPU (IC9.28)
PC3_ADC3_IN1_P: Stabilizer (J3.28), CPU (IC9.29)
PoE_SRC_Status: Supply_Stabilizer (R190.1 R191.2), CPU (IC9.136)
POE_VC+: Supply_Stabilizer (L19.1 R140.2), RMII_Ethernet (5 pins)
POE_VC-: Supply_Stabilizer (6 pins), RMII_Ethernet (5 pins)
QSPI_CLK: Stabilizer (J3.8), CPU (R12.1)
QSPI_IO0: Stabilizer (J3.6), CPU (R186.2)
QSPI_IO1: Stabilizer (J3.5), CPU (R187.2)
QSPI_IO2: Stabilizer (J3.3), CPU (R188.2)
QSPI_IO3: Stabilizer (J3.2), CPU (R189.2)
QSPI_NCS: Stabilizer (J3.9), CPU (R185.1)
REF_P1V7066: Input_AFE0 (R85A.1 RN2A.5 RN2A.8), Input_AFE1 (R85B.1 RN2B.5 RN2B.8), References (IC34.7 R72.2 RN4.7)
REF_P2V048: Input_AFE0 (R91A.1), Input_AFE1 (R91B.1), References (IC34.1 RN3.6 RN4.3)
REF_P4V096_ADC: ADC_1CH (C16A.1 C100A.2 IC38A.3), References (R94.2)
REF_P4V096_ADC: ADC_1CH (C16B.1 C100B.2 IC38B.3), References (R34.2)
REF_P4V096_DAC1: DAC_1CH0 (6 pins), References (R106.2)
REF_P4V096_DAC2: References (R105.2), DAC_1CH1 (6 pins)
REF_~{SHDN}: Supply_Stabilizer (D6.3 IC12.7 R57.1), References (IC33.1 IC42.1)
RMII_CRS_DV: RMII_Ethernet (R50.1), CPU (IC9.43)
RMII_MDC: RMII_Ethernet (IC11.13), CPU (IC9.27)
RMII_MDIO: RMII_Ethernet (IC11.12 R98.2), CPU (IC9.36)
RMII_REF_CLK: RMII_Ethernet (R60.1), CPU (IC9.35)
RMII_RXD0: RMII_Ethernet (R45.1), CPU (IC9.44)
RMII_RXD1: RMII_Ethernet (R46.1), CPU (IC9.45)
RMII_TX_EN: RMII_Ethernet (IC11.16), CPU (IC9.70)
RMII_TXD0: RMII_Ethernet (IC11.17), CPU (IC9.73)
RMII_TXD1: RMII_Ethernet (IC11.18), CPU (IC9.129)
SCKI: CPU (IC9.128), EEM_connector (R110.1)
SDI: CPU (IC9.135), EEM_connector (R108.1)
SDO: CPU (IC9.127), EEM_connector (R113.1)
SPI1_MISO: Stabilizer (J3.21), CPU (R136.2)
SPI1_MOSI: Stabilizer (J3.20), CPU (R128.2)
SPI1_NSS: Stabilizer (J3.23), CPU (R131.1)
SPI1_SCK: Stabilizer (J3.24), CPU (R132.1)
SPI2_MISO: CPU (IC9.75), ADC_1CH (IC1B.6 R123B.2)
SPI2_NSS: CPU (IC9.140), ADC_1CH (IC5B.1)
SPI2_SCK: CPU (IC9.69), ADC_1CH (IC5B.3)
SPI3_MISO: CPU (IC9.134), ADC_1CH (IC1A.6 R123A.2)
SPI3_SCK: CPU (IC9.111), ADC_1CH (IC5A.3)
SPI4_MOSI: CPU (IC9.4), DAC_1CH0 (IC37A.9 IC46A.10 TP5A.1)
SPI4_NSS: CPU (IC9.3), DAC_1CH0 (IC37A.6 IC46A.7 TP18A.1)
SPI4_SCK: CPU (IC9.1), DAC_1CH0 (IC37A.8 IC46A.8 TP4A.1)
SPI5_MOSI: CPU (IC9.20), DAC_1CH1 (IC37B.9 IC46B.10 TP5B.1)
SPI5_NSS: CPU (IC9.18), DAC_1CH1 (IC37B.6 IC46B.7 TP18B.1)
SPI5_SCK: CPU (IC9.19), DAC_1CH1 (IC37B.8 IC46B.8 TP4B.1)
TDI: CPU (D28.1 IC9.110 J8.8 R33.2), ADC_1CH (IC5A.1)
TERM_STAT0: Stabilizer (R5.2 T4.1), CPU (IC9.80), Input_AFE0 (SW1A.2)
TERM_STAT1: Stabilizer (R93.2 T2.1), CPU (IC9.90), Input_AFE1 (SW1B.2)
USART3_RX: Stabilizer (W1.2), CPU (IC9.78)
USART3_TX: Stabilizer (W1.3), CPU (IC9.77)
USB_ID: USB (C108.2 D22.6 FB2.1), CPU (IC9.102)
USB_N: USB (D22.4 L9.2), CPU (IC9.103)
USB_P: USB (D22.3 L9.3), CPU (IC9.104)
VBUS_DET: USB (R73.1 R75.2), CPU (IC9.101)

## Assembly variants
Standard_DCjack: not fitted C5 C10 C11 C102 C103 C116 C136 C168 C170 CON1 IC1A IC1B IC4 IC6 IC7 IC23 IC33 IC36 IC37A IC37B IC39 IC40 IC41 IC44 IC47 L8A L8B R7 R79A R79B R86A R86B R124 R170A R170B R171A R171B R172A R172B R173 R174 R175 R179 R225 R226 R227 TP1A TP1B TP2A TP2B TP3A TP3B TP4A TP4B TP5A TP5B TP6 TP7 TP8 TP9 TP10 TP11 TP12 TP13 TP14 TP15 TP16 TP17 TP18A TP18B TP19A TP19B TP21